# EAGLE design untitled (EAGLE 5.11)
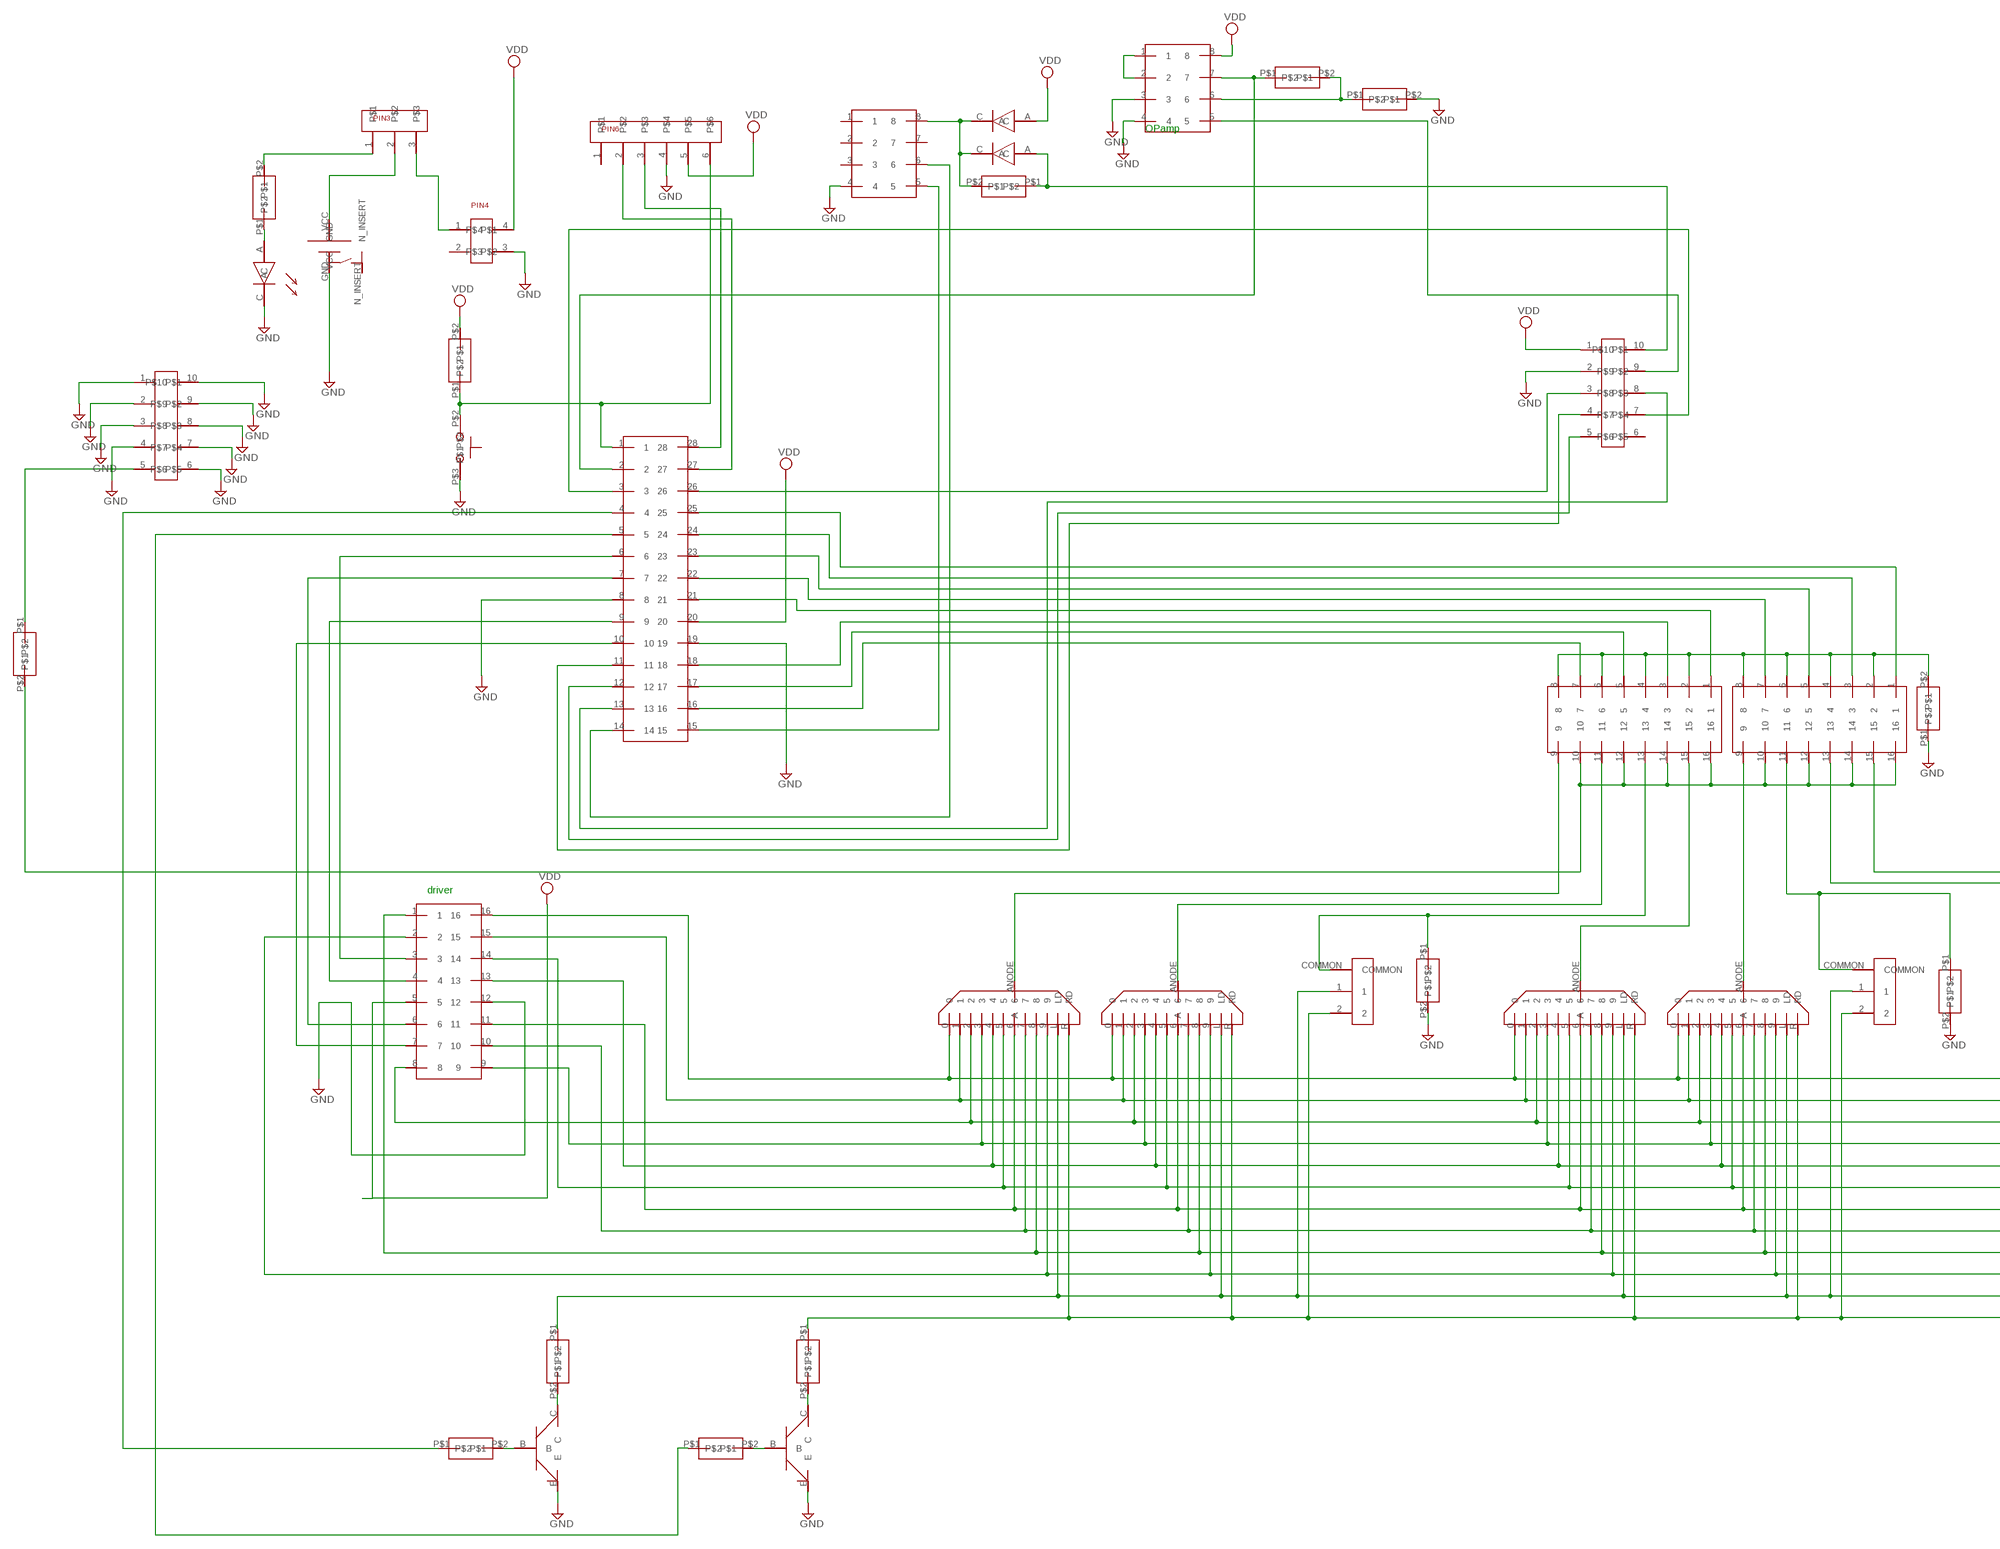
[diagram p0: schematic, sheet 1, part 1 of 2]
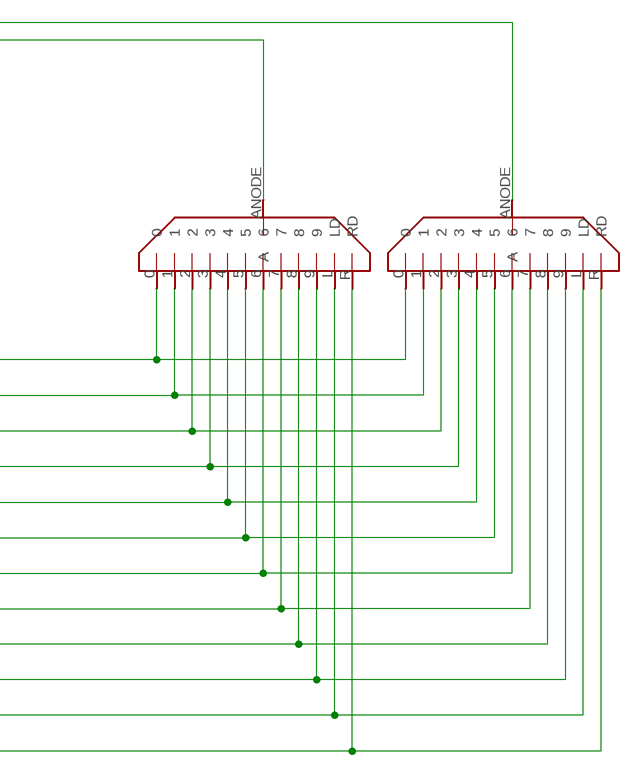
[diagram p1: schematic, sheet 1, part 2 of 2]

## Parts
U$1  DIP28  [DIP28]
U$2  DIP16  [DIP16]
U$3  DIP16  [DIP16]
U$4  DIP16  [DIP16]
U$5  DIP8  [DIP8]
U$6  DIP8  [DIP8]
U$7  NIXIE  [NIXIE]
U$8  NIXIE  [NIXIE]
U$9  NIXIE  [NIXIE]
U$10  NIXIE  [NIXIE]
U$11  NIXIE  [NIXIE]
U$12  NIXIE  [NIXIE]
U$13  NEON_COLON  [NEON_COLON]
U$14  NEON_COLON  [NEON_COLON]
U$15  ACADUPTER  [ACADUPTER]
U$16  PIN10  [PIN10]
U$17  PIN10  [PIN10]
U$18  DIORDE  [DIORDE]
U$19  DIORDE  [DIORDE]
U$20  REGISTER  [REGISTER]
U$21  REGISTER  [REGISTER]
U$22  TRANSISTOR  [TRANSISTOR]
U$23  TRANSISTOR  [TRANSISTOR]
U$24  REGISTOR_STAND  [REGISTOR_STAND]
U$25  REGISTOR_STAND  [REGISTOR_STAND]
U$26  REGISTER  [REGISTER]
U$27  REGISTER  [REGISTER]
U$28  PIN4  [PIN4]
U$29  PIN6  [PIN6]
U$30  REGISTER  [REGISTER]
U$31  SWITCH  [SWITCH]
U$32  REGISTER  [REGISTER]
U$33  REGISTOR_STAND  [REGISTOR_STAND]
U$34  REGISTOR_STAND  [REGISTOR_STAND]
U$35  PIN3  [PIN3]
U$36  LED  [LED]
U$37  REGISTOR_STAND  [REGISTOR_STAND]
U$38  REGISTER  [REGISTER]
U$39  REGISTER  [REGISTER]

## Nets
GND: U$1.8 U$1.19 U$2.12 U$5.4 U$6.3 U$6.4 U$15.GND U$16.1 U$16.2 U$16.3 U$16.4 U$16.6 U$16.7 U$16.8 U$16.9 U$16.10 U$17.2 U$21.P$1 U$22.E U$23.E U$27.P$2 U$28.3 U$29.4 U$31.P$3 U$36.C U$38.P$2 U$39.P$2
N$1: U$1.6 U$2.3
N$2: U$17.10 U$19.A U$20.P$1
N$3: U$1.12 U$17.5
N$4: U$1.15 U$5.5
N$5: U$1.14 U$5.6
N$6: U$3.13 U$13.COMMON U$38.P$1
N$7: U$2.16 U$7.0 U$8.0 U$9.0 U$10.0 U$11.0 U$12.0
N$8: U$2.8 U$7.2 U$8.2 U$9.2 U$10.2 U$11.2 U$12.2
N$9: U$2.9 U$7.3 U$8.3 U$9.3 U$10.3 U$11.3 U$12.3
N$10: U$2.13 U$7.4 U$8.4 U$9.4 U$10.4 U$11.4 U$12.4
N$11: U$2.14 U$7.5 U$8.5 U$9.5 U$10.5 U$11.5 U$12.5
N$12: U$2.11 U$7.6 U$8.6 U$9.6 U$10.6 U$11.6 U$12.6
N$13: U$2.10 U$7.7 U$8.7 U$9.7 U$10.7 U$11.7 U$12.7
N$14: U$2.1 U$7.8 U$8.8 U$9.8 U$10.8 U$11.8 U$12.8
N$15: U$2.2 U$7.9 U$8.9 U$9.9 U$10.9 U$11.9 U$12.9
N$17: U$4.11 U$14.COMMON U$39.P$1
N$18: U$16.5 U$32.P$1
N$19: U$4.15 U$7.ANODE(A)
N$20: U$22.B U$33.P$2
N$21: U$1.7 U$2.6
N$22: U$4.13 U$9.ANODE(A)
N$23: U$23.B U$34.P$2
N$24: U$1.11 U$17.4
N$27: U$3.10 U$3.12 U$3.14 U$3.16 U$4.10 U$4.12 U$4.14 U$4.16 U$32.P$2
N$28: U$1.1 U$29.6 U$30.P$1 U$31.P$2
N$30: U$1.16 U$3.7
N$31: U$1.17 U$3.5
N$32: U$1.18 U$3.3
N$33: U$1.21 U$3.1
N$34: U$1.22 U$4.7
N$35: U$1.23 U$4.5
N$36: U$1.24 U$4.3
N$37: U$1.25 U$4.1
N$38: U$1.10 U$2.7
N$39: U$5.8 U$18.C U$19.C U$20.P$2
N$40: U$1.9 U$2.4
N$41: U$22.C U$24.P$2
N$42: U$23.C U$25.P$2
N$43: U$1.28 U$29.3
N$44: U$1.26 U$17.3
N$45: U$1.27 U$29.2
N$46: U$1.2 U$6.7 U$26.P$1
N$47: U$6.6 U$26.P$2 U$27.P$1
N$48: U$6.5 U$17.9
N$49: U$6.1 U$6.2
N$50: U$1.4 U$33.P$1
N$51: U$1.5 U$34.P$1
N$52: U$28.1 U$35.3
N$53: U$4.9 U$11.ANODE(A)
N$54: U$1.13 U$17.8
N$55: U$3.15 U$8.ANODE(A)
N$56: U$3.11 U$10.ANODE(A)
N$57: U$3.9 U$12.ANODE(A)
N$59: U$7.R(RD) U$8.R(RD) U$9.R(RD) U$10.R(RD) U$11.R(RD) U$12.R(RD) U$13.2 U$14.2 U$25.P$1
N$60: U$15.VCC U$35.2
N$61: U$35.1 U$37.P$2
N$62: U$36.A U$37.P$1
N$63: U$1.3 U$17.7
N$64: U$3.2 U$3.4 U$3.6 U$3.8 U$4.2 U$4.4 U$4.6 U$4.8 U$21.P$2
N$65: U$2.15 U$7.1 U$8.1 U$9.1 U$10.1 U$11.1 U$12.1
N$66: U$7.L(LD) U$8.L(LD) U$9.L(LD) U$10.L(LD) U$11.L(LD) U$12.L(LD) U$13.1 U$14.1 U$24.P$1
VDD: U$1.20 U$2.5 U$6.8 U$17.1 U$18.A U$28.4 U$29.5 U$30.P$2
Unconnected: U$5.1 U$5.2 U$5.3 U$5.7 U$15.N_INSERT U$17.6 U$28.2 U$29.1

## Notes on the sheet
- OPamp
- driver

## Library data of the parts
U$1 = mylib:DIP28
U$2-U$4 = mylib:DIP16
U$5 U$6 = mylib:DIP8
U$7-U$12 = mylib:NIXIE: IN-16 Nixie Tube
U$13 U$14 = mylib:NEON_COLON
U$15 = mylib:ACADUPTER
U$16 U$17 = mylib:PIN10
U$18 U$19 = mylib:DIORDE
U$20 U$21 U$26 U$27 U$30 U$32 U$38 U$39 = mylib:REGISTER
U$22 U$23 = mylib:TRANSISTOR
U$24 U$25 U$33 U$34 U$37 = mylib:REGISTOR_STAND
U$28 = mylib:PIN4
U$29 = mylib:PIN6
U$31 = mylib:SWITCH
U$35 = mylib:PIN3
U$36 = mylib:LED

## Board
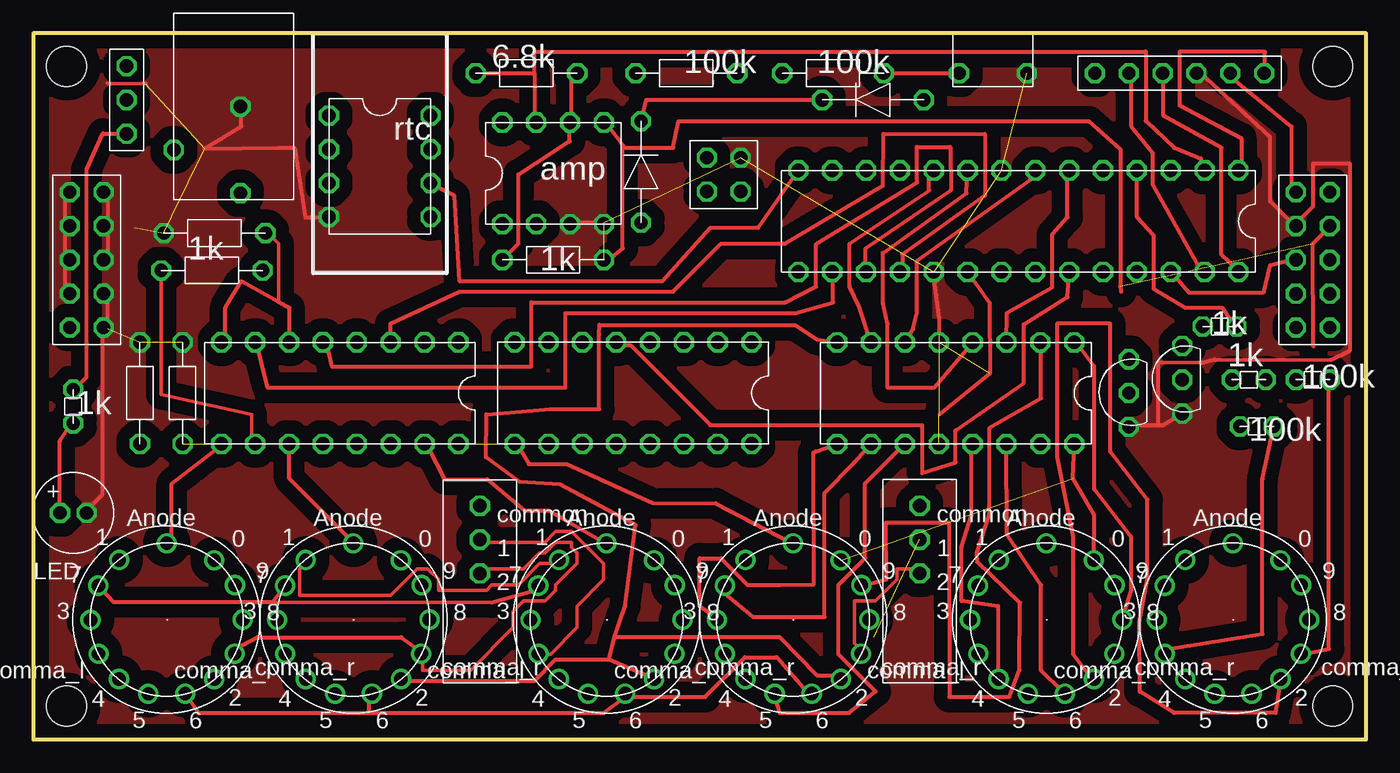
[diagram p2: board, top side]
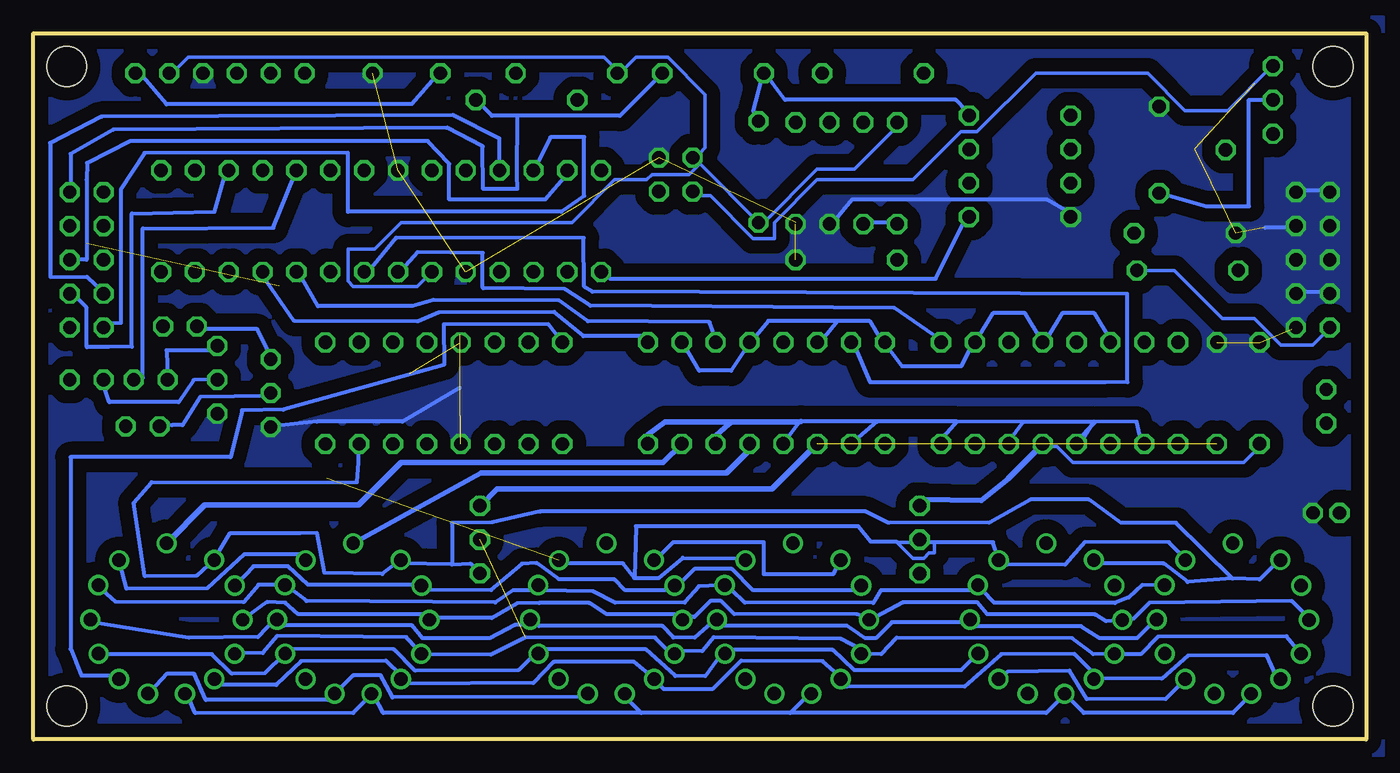
[diagram p3: board, bottom side, seen from below]

Size 100 x 53 mm. Coordinates in mm from the lower left corner, seen from the top.
Outline: 0,0 100,0 100,53 0,53 0,0
Copper layers (1*16): Top 0.035mm / dielectric 1.5mm / Bottom 0.035mm
Design rules "default": minimum track width 10mil, minimum drill 24mil, track to track 8mil, track to pad 8mil, pad to pad 8mil, via to via 8mil, smd to smd 8mil, copper to edge 40mil, drill to drill 8mil, minimum pad ring 10mil, minimum via ring 8mil, stop-mask expansion 4mil, vias tented up to drill 0mil, thermal gap 10mil
Holes 3 mm at 2.5,2.5 97.5,2.5 97.5,50.5 2.5,50.5

### Footprints (pad centres in the part's own frame; a part is rotated, then mirrored left to right if it is on the bottom)
DIP28 = drill 1 octagon: 1 -3.81,16.51; 2 -3.81,13.97; 3 -3.81,11.43; 4 -3.81,8.89; 5 -3.81,6.35; 6 -3.81,3.81; 7 -3.81,1.27; 8 -3.81,-1.27; 9 -3.81,-3.81; 10 -3.81,-6.35; 11 -3.81,-8.89; 12 -3.81,-11.43; 13 -3.81,-13.97; 14 -3.81,-16.51; 15 3.81,-16.51; 16 3.81,-13.97; 17 3.81,-11.43; 18 3.81,-8.89; 19 3.81,-6.35; 20 3.81,-3.81; 21 3.81,-1.27; 22 3.81,1.27; 23 3.81,3.81; 24 3.81,6.35; 25 3.81,8.89; 26 3.81,11.43; 27 3.81,13.97; 28 3.81,16.51
DIP16 = drill 1 octagon: 1 -3.81,8.89; 2 -3.81,6.35; 3 -3.81,3.81; 4 -3.81,1.27; 5 -3.81,-1.27; 6 -3.81,-3.81; 7 -3.81,-6.35; 8 -3.81,-8.89; 9 3.81,-8.89; 10 3.81,-6.35; 11 3.81,-3.81; 12 3.81,-1.27; 13 3.81,1.27; 14 3.81,3.81; 15 3.81,6.35; 16 3.81,8.89
DIP8 = drill 1 octagon: 1 -3.81,3.81; 2 -3.81,1.27; 3 -3.81,-1.27; 4 -3.81,-3.81; 5 3.81,-3.81; 6 3.81,-1.27; 7 3.81,1.27; 8 3.81,3.81
NIXIE = drill 1 round: 0 3.571,4.455; 1 -3.568,4.469; 2 3.58,-4.46; 3 -5.71,-0.024; 4 -3.578,-4.464; 5 1.4,-5.56; 6 -1.373,-5.57; 7 -5.116,2.549; 8 5.719,0; 9 5.122,2.587; ANODE 0.003,5.733; L -5.106,-2.567; R 5.102,-2.555
NEON_COLON = drill 1 octagon: 1 0,0; 2 0,-2.54; COMMON 0,2.54
ACADUPTER = drill 1 octagon: GND -3.5,0; N_INSERT -0.25,-5; VCC 3,0
PIN10 = drill 1 octagon: 1 -1.27,5.08; 2 -1.27,2.54; 3 -1.27,0; 4 -1.27,-2.54; 5 -1.27,-5.08; 6 1.27,-5.08; 7 1.27,-2.54; 8 1.27,0; 9 1.27,2.54; 10 1.27,5.08
DIORDE = drill 1 octagon: A -3.81,0; C 3.81,0
REGISTER = drill 1 octagon: P$1 -3.81,0; P$2 3.81,0
TRANSISTOR = drill 1 octagon: B 2.54,0; C 0,0; E -2.54,0
REGISTOR_STAND = drill 1 octagon: P$1 -1.27,0; P$2 1.27,0
PIN4 = drill 1 octagon: 1 -1.27,1.27; 2 -1.27,-1.27; 3 1.27,-1.27; 4 1.27,1.27
PIN6 = drill 1 octagon: 1 -6.35,0; 2 -3.81,0; 3 -1.27,0; 4 1.27,0; 5 3.81,0; 6 6.35,0
SWITCH = drill 1 octagon: P$2 -2.54,0; P$3 2.54,0
PIN3 = drill 1 octagon: 1 -2.54,0; 2 0,0; 3 2.54,0
LED = drill 1 octagon: A -1,0; C 1,0

### Placement (x,y rotation side)
U$1  73.91,38.9 270 top
U$2  69.21,25.99 270 top
U$3  23,26 270 top
U$4  45,26 270 top
U$5  25.99,43.02 0 top
U$6  39,42.5 90 top
U$7  90,9 0 top
U$8  43,9 0 top
U$9  76,9 0 top
U$10  24,9 0 top
U$11  57,9 0 top
U$12  10,9 0 top
U$13  33.5,15 0 top
U$14  66.5,15 0 top
U$15  15.54,44 270 top
U$16  4,36 0 top
U$17  96,36 0 top
U$18  45.6,42.6 90 top
U$19  63,48 180 top
U$20  49,50 180 top
U$21  13.6,38 0 top
U$22  82.2,26 90 top
U$23  86.2,27 90 top
U$24  91.8,23.5 180 top
U$25  96,27 180 top
U$26  37,50 0 top
U$27  39,36 0 top
U$28  51.8,42.4 90 top
U$29  86,50 0 top
U$30  60,50 180 top
U$31  72,50 0 top
U$32  13.4,35.2 180 top
U$33  89,31 180 top
U$34  91.2,27 180 top
U$35  7,48 90 top
U$36  3,17 0 top
U$37  3,25 90 top
U$38  8,26 90 top
U$39  11.2,26 90 top

### Tracks (layer width: path | path; a pad name or v marks a point on that pad's centre or on a via)
GND  (12 unrouted)
  Top 0.254: 8.46,49.26 8.4,49.2 5.6,49.2 5.55,49.27
  Top 0.3: U$29.4 87.6,50 92.8,45.2 92.8,40.4 94.4,38.8 U$17.2 94.8,38.8 96,40 96,43.2 98.8,43.2 98.8,29.2 97.34,28.5 88.58,28.53 87.7,28.29 84.4,28.32 84.4,23.6 | 84.4,23.6 84.8,23.6 U$23.E | 84.4,23.6 82.4,23.6 U$22.E | 68,30.4 68,31.6 67.6,34.4 U$1.19 | U$6.3 40.4,38.8 42.8,38.8 U$6.4 | U$5.4 22,39.2 20.4,39.2 19.6,44.4 18.4,44.4 12.85,44.35 15.6,46 15.6,47.2 U$15.GND | U$16.8 5.6,36.4 5.6,38.4 U$16.9 5.6,38.8 5.6,40.8 U$16.10 | U$16.4 2.4,33.6 2.4,36 U$16.3 2.4,36.4 2.4,38.4 U$16.2 2.4,38.8 2.4,40.8 U$16.1 | U$36.C 4,17.2 5.2,18.4 5.2,30.8 U$16.6 5.6,31.2 5.6,33.2 U$16.7
  Bottom 0.3: 68,26.4 72.31,23.86 78.71,23.86 82.17,23.48 U$22.E | 7.6,38.4 5.6,38.4 U$16.9 | U$16.4 2.8,33.6 5.2,33.6 U$16.7 | U$16.10 5.2,41.2 2.8,41.2 U$16.1 | U$6.3 40,38.8 38.59,40.52 23.91,40.52 22.4,39.6 U$5.4 | U$16.6 5.6,30.8
  pour Top (isolate 1.016, rank 6, no thermals): -0.94,53.88 100.47,53.48 100.47,-0.47 -0.54,-0.47
  pour Bottom (isolate 1.016, rank 6, no thermals): -1.27,54.21 100.8,53.81 100.8,-0.8 -1.27,-1.2
N$1
  Top 0.3: U$2.3 73.04,32 76.44,33.92 76.44,37.92 77.6,39.2 77.6,42.4 U$1.6
N$2
  Bottom 0.3: 63.69,46.82 65.6,46.8 U$19.A | 63.69,46.82 56,46.8 U$20.P$1 | 63.69,46.82 63.74,42.38 63.7,41.32 66.25,41.31 66.29,44.52 68.96,45.91 94.04,45.76 97.21,43.97 97.2,41.2 U$17.10
N$3
  Bottom 0.3: U$1.12 62.4,42.8 61.2,45.2 58.67,45.22 58.67,40.82 60.4,39.6 76.4,39.6 76.4,44.04 91.66,44.02 93.43,41.27 93.43,31.27 94.4,31.2 U$17.5
N$4
  Bottom 0.3: U$5.5 30,39.2 32.31,34.56 56.71,34.56 U$1.15
N$5
  Top 0.3: U$5.6 30,41.6 31.6,40.8 32,34.4 47.2,34.4 50.8,38.4 54.4,38.4 57.2,42.4 U$1.14
N$6
  Bottom 0.254: U$38.P$1 8,22 9.2,20.8 22,20.8 23.2,22 24,22 U$3.13
  Bottom 0.406: U$13.COMMON 33.6,17.54 33.6,18 28.86,17.94 26.8,19.6 26.86,19.6 U$3.13
N$7  (1 unrouted)
  Top 0.3: U$9.0 79.6,16.8 78,19.6 U$2.16
  Bottom 0.254: 32.4,14.8 32.4,14 32.8,14 33.2,13.6 34,13.6 35.2,14.8 35.2,14.82
  Bottom 0.3: U$7.0 93.48,13.15 93,11.31 86.95,11.35 84.18,13.91 79.78,13.91 U$9.0 | 54.9,12.13 55.74,13.21 60.4,13.2 U$11.0 | 54.9,12.13 53.07,12.11 51.26,13.63 46.8,13.6 U$8.0 | U$12.0 13.6,13.6 14.8,14.8 21.12,14.82 22.57,13.13 26.93,13.11 U$10.0 27.6,13.6 28,14.8 32.4,14.8 33.2,14.8 | 54.9,12.13 54.8,16 38.1,16 37.16,14.84 35.2,14.82 33.6,14.8
N$8
  Top 0.3: 43.6,7.7 56,7.7 58.8,4.8 60.4,4.8 U$11.2 | 43.2,6 46,4.8 U$8.2 | 43.2,6 43.6,7.7 | 43.2,6 39.2,6 37.6,4.4 27.6,4.4 U$10.2 | U$9.2 79.2,4.8 78,6.4 78,15.2 76.8,21.2 76.8,31.2 80.8,31.2 80.8,21.6 83.6,18 83.6,12 82.98,8.81 83,3.62 85.6,2 93.2,2 U$7.2 | 43.6,7.7 44.4,10 45.2,16.1 39.51,19.14 36.5,19.33 33.96,21.17 34,24.4 38.8,24.8 42.46,24.8 42.46,30.4 42.48,31.12 57.16,31.1 58.8,30 U$2.8
  Bottom 0.3: U$12.2 13.84,4.24 15.04,3.04 20.96,3.02 22.26,5.17 26.93,5.07 U$10.2 | U$7.2 93.6,4.8 96.4,4.8 97.2,6.8 97.2,21.2 85.2,21.2 84.34,24.7 81.22,24.76 69.2,28.11 69.21,31.15 61.36,31.18 60.21,29.72 U$2.8
N$9
  Top 0.3: U$2.9 58.71,21.62 58.51,21.52 58.56,11.66 56,11.6 53.6,11.6 51.6,13.6 50,13.6 50,10 51.2,9.2 U$11.3
  Bottom 0.3: U$12.3 4.4,9.2 5.6,10.4 16.26,10.27 17.46,9.07 U$10.3 19.5,8.87 20.33,9.38 28.42,9.4 29.16,10.29 34.76,10.29 36.8,9.2 U$8.3 37.6,9.2 38.22,9.41 47.43,9.42 48.4,10.4 49.2,10.4 50.4,9.2 51.2,9.2 U$11.3 51.63,9.38 56.95,9.41 58.29,10.24 62.05,10.25 63.69,10.22 65.58,9.13 69.91,9.13 70,9.2 U$9.3 70.58,9.38 80.12,9.4 81.09,10.27 82.44,10.32 84,9.2 U$7.3
N$10
  Top 0.3: U$2.13 70.4,22 70.4,16.8 69.63,14.4 69.63,10.4 72.4,10 72.4,4.8 U$9.4
  Bottom 0.3: U$12.4 6.8,4.8 7.47,6.33 13.37,6.29 15.34,4.57 20.64,4.6 U$10.4 20.7,5.23 21.9,6.43 27.37,6.41 30.14,3.96 38.99,3.99 U$8.4 39.6,4.8 40.78,5.87 46.9,5.92 49.06,3.78 52.69,3.78 U$11.4 53.4,4.54 54.95,5.84 60.96,5.82 62.48,4.25 71.96,4.19 U$9.4 72.42,4.83 73.54,5.92 79.92,5.89 81.76,4.09 86.37,4.09 U$7.4
N$11
  Top 0.3: 25.2,2 12.4,2 11.6,3.2 U$12.5 | 25.2,2 25.2,3.2 U$10.5 | 25.2,2 42.8,2 44.4,3.2 U$8.5 44.8,3.2 50.4,3.2 53.38,6.17 55.78,6.17 58,3.6 U$11.5 | U$2.14 73.04,15.4 75.6,11.6 75.6,5.2 77.2,3.6 U$9.5
  Bottom 0.3: U$11.5 58.4,3.2 73.06,3.15 73.96,4.83 76,4.8 77.2,3.6 U$9.5 77.86,2.97 87.06,2.97 87.93,4.93 90,4.93 91.2,3.6 U$7.5
N$12
  Top 0.3: U$2.11 64.4,21.2 62.4,19.2 62.4,13.6 60.4,11.6 60.4,6.4 63.2,3.6 61.2,2 56,2 55.6,3.2 U$11.6
  Bottom 0.3: U$12.6 8.8,3.2 10,2 21.2,2 22.4,3.2 U$10.6 22.8,3.2 24,2 43.2,2 | U$7.6 88.4,3.2 87.85,1.98 76,2 74.8,3.2 U$9.6 74.4,3.2 73.75,2 54.4,2 | 43.2,2 42,3.2 U$8.6 | 43.2,2 54.4,2 | 54.4,2 55.6,3.2 U$11.6
N$13
  Top 0.3: 18,10.32 6,10.32 5.2,11.2 U$12.7 | U$2.10 61.6,20.8 59.36,18.51 59.36,9.2 54,9.2 51.6,11.2 U$11.7 | 18,10.32 34.4,10.29 37.6,11.2 U$8.7 | 18,10.32 U$10.7
  Bottom 0.3: U$7.7 84.8,11.6 83.47,13 80.88,13.01 79.39,11.62 71.2,11.6 U$9.7 70.8,11.2 65.64,11.22 63.34,13.19 62.26,13.24 60.57,12.03 56.4,12 55.6,11.2 52,11.2 U$11.7 51.6,11.6 50.4,12.8 47.6,12.8 46,11.2 38.4,11.2 38,11.6 U$8.7
N$14
  Top 0.3: U$2.1 78.4,29.6 79.6,28 79.6,18.8 82.37,15.22 82.4,11.2 82,10 U$9.8
  Bottom 0.3: U$7.8 95.6,8.8 88.33,7.65 83.14,7.7 81.93,8.96 U$9.8 81.6,8.8 81.2,8.56 71.6,8.56 70.8,7.6 65.76,7.6 63.88,8.6 62.83,8.6 U$11.8 62.4,8.8 62.08,8.53 52.81,8.53 51.98,7.67 50.38,7.63 49.13,8.77 U$8.8 48.4,8.8 48.57,8.54 38.97,8.54 37.6,7.6 36.8,7.6 35.6,8.8 30,8.8 U$10.8 29.4,8.51 21.41,8.51 20,7.6 17.2,7.6 16,8.8 U$12.8
N$15
  Top 0.3: U$2.2 75.6,29.2 75.6,25.6 71.75,23.36 71.73,16.85 70.8,14 70.83,13.32 74.04,10.26 74,5.2 73.24,3.22 68.72,3.2 68.69,16.28 63.97,16.28 64,12 62.4,11.6 U$11.9
  Bottom 0.3: U$12.9 16.8,11.6 17.81,10.66 18.85,10.25 27.9,10.26 28.8,11.2 U$10.9 29.2,11.2 36.4,11.2 36.98,10.26 46.63,10.29 47.6,11.2 U$8.9 48.56,11.56 50.06,11.49 51.14,10.29 56.34,10.27 58.02,11.13 62,11.2 62.12,11.32 U$11.9 62.4,11.2 64,11.2 65.34,10.29 79.49,10.4 80.56,11.18 U$9.9 81.51,11.62 83.11,11.62 84.22,10.3 93.84,10.34 94.8,11.2 U$7.9
N$17  (1 unrouted)
  Bottom 0.406: U$14.COMMON 66.46,17.54 65.2,18.8 44.58,18.8 U$4.11
N$18
  Bottom 0.254: 2.8,30.8 4,29.6 6.4,29.6 8.4,31.6 10.8,31.6 14.4,35.2 U$32.P$1
  Bottom 0.3: 2.68,30.8 2.8,30.8 U$16.5
N$19
  Bottom 0.406: U$4.15 52.74,20.8 72.4,20.8 75.6,17.6 87.13,17.6 U$7.ANODE
N$20
  Bottom 0.3: U$22.B 82,28.4 83.2,30.8 87.6,30.8 U$33.P$2
N$21
  Top 0.3: U$2.6 66,30.8 66.28,32 66.31,35.93 74.8,42 74.8,42.4 U$1.7
N$22
  Bottom 0.3: U$9.ANODE 76,14.8
  Bottom 0.406: U$4.13 46.27,21.73 48,20 66.4,20 U$9.ANODE
N$23
  Bottom 0.3: U$23.B 86.4,29.2 90,29.2 U$34.P$2
N$24
  Bottom 0.3: U$1.11 65.03,45.1 68.51,46.86 94.9,46.73 98.75,44.77 98.73,34.71 95.98,34.74 94.8,33.6 U$17.4
N$27
  Top 0.254: U$32.P$2 9.6,34.68 9.6,25.88 16.4,24.4 16.4,22.4 U$3.10
  Bottom 0.3: U$3.10 16.8,22 17.22,23.84 20.44,23.87 21.6,22 U$3.12 21.75,22.38 20.31,23.84 25.74,23.84 | 25.74,23.84 26.8,22.4 U$3.14 | 25.74,23.84 30.7,23.87 | 30.7,23.87 32,22.4 U$3.16 | 36.7,23.87 38.4,22.4 U$4.10 | 30.7,23.87 36.7,23.87 | 36.7,23.87 42.4,23.86 42.52,23.86 43.6,22.4 U$4.12 44,22
  Bottom 0.406: U$4.14 48.81,22.79 47.76,23.73 | 47.76,23.73 47.64,23.85 42.58,23.85 42.4,23.86 | U$4.16 53.89,22.91 52.59,23.84 47.82,23.84 47.76,23.73
N$28
  Top 0.3: U$30.P$1 U$31.P$2 | U$1.1 90.4,42.8 90.63,43.14 90.63,45.14 86,47.6 86,51.6 92.4,51.6 92.4,50 U$29.6
  Bottom 0.3: U$31.P$2 69.6,50 71.61,47.69 90,47.67 92,50 U$29.6
N$30
  Top 0.3: U$3.7 16.8,29.6 17.6,26.4 39.92,26.4 39.92,32 57.2,32 60,32.8 60,34.4 U$1.16
N$31
  Top 0.3: U$3.5 22,29.6 22.4,28 37.38,28 37.38,32.8 56.4,32.8 58.72,33.98 58.72,37.18 66.3,41.8 66.28,44.47 68.8,44.47 68.84,41.2 62.4,36.8 62.4,35.2 U$1.17
N$32
  Top 0.3: U$3.3 26.8,30 26.8,31.2 32,33.6 48,33.6 51.6,37.2 56.4,37.2 63.74,41.55 63.78,45.45 71.38,45.44 71.38,40.8 65.2,36.4 65.2,35.2 U$1.18
N$33
  Bottom 0.3: U$3.1 32,30 35.41,32.4 58.21,32.55 60.1,33.8 66.25,33.86 66.31,33.97 66.28,36.52 71.19,36.58 72.4,35.2 U$1.21
N$34
  Bottom 0.3: U$4.7 38.4,29.6 37.2,26.8 19.6,26.8 17.9,26.82 17.92,33.44 58.05,33.61 58.67,34.01 58.7,37.64 72.77,37.65 74.8,35.2 U$1.22
N$35
  Top 0.3: U$4.5 44,29.6 44.8,29.6 50.8,23.6 66.69,23.6 66.69,20 69.2,20.8 69.2,23.2 74.3,26.76 74.3,31.16 77.6,33.2 U$1.23
N$36
  Bottom 0.3: U$4.3 48.8,30 49.27,31.31 58.41,31.39 60.56,32.95 69.98,32.99 71.56,32.53 78.65,32.52 80,34.8 U$1.24
N$37
  Bottom 0.3: U$4.1 54,30 53.94,30.27 58.73,30.27 60.92,32.08 69.58,32.05 71.18,31.38 80.42,31.41 82.8,34.8 U$1.25
N$38
  Top 0.3: U$2.7 62,32.4 61.24,34 61.24,37.2 67.2,41.2 67.2,42.4 U$1.10
N$39
  Top 0.3: U$19.C 46,48 U$18.C
  Bottom 0.3: 45.22,50.2 44.8,50 U$20.P$2 | 45.22,50.2 43.6,48 30.8,48 30,47.2 U$5.8 | 45.22,50.2 46,47.2 U$18.C
N$40
  Top 0.3: U$2.4 67.6,26.4 64.1,26.4 64.1,31.2 63.75,32.79 63.74,36.52 70.02,41 U$1.9
N$41
  Bottom 0.3: U$24.P$2 89.6,23.6 88.8,23.6 87.47,25.71 82.39,25.78 82.4,26 U$22.C
N$42
  Bottom 0.3: U$23.C 87.97,26.97 89.11,25.33 94.31,25.33 94.8,26.8 U$25.P$2
N$43
  Top 0.3: U$29.3 84.8,50 84.8,46.8 89.14,44.4 89.14,36.4 90.4,35.2 U$1.28
N$44
  Top 0.3: U$1.26 85.6,34.8 86.71,33.55 92.31,33.55 92.8,35.6 94.4,36 U$17.3
N$45
  Top 0.3: U$1.27 87.6,35.2 84,41.6 84,44 82.4,46 82.4,50 U$29.2
N$46
  Top 0.3: 37.6,50 37.6,46.4 U$6.7 | U$26.P$1 37.6,50 | 37.6,50 37.6,51.6 83.46,51.64 83.46,46.44 85.6,44.4 87.6,43.6 U$1.2
N$47
  Top 0.3: U$27.P$1 36.4,37.2 36.4,42.4 40.23,44.9 U$6.6 40.4,46.4 40.4,49.6 U$26.P$2
N$48  (1 unrouted)
  Top 0.3: 43.2,36 44.21,36.85 44.21,44.45 44.4,44.4 | 44.4,44.4 43.2,46 U$6.5 | 96.04,29.51 96,37.2 97.2,38.4 U$17.9 | 81.6,33.6 81.54,34.02 81.54,44.32 79.2,46.4 48.4,46.4 48,44.4 44.4,44.4
N$49
  Bottom 0.3: U$6.1 35.2,38.8 37.6,38.8 U$6.2
N$50
  Top 0.3: U$33.P$1 90,31.2 89.2,32.4 86.4,32.4 84.06,33.82 84.06,37.82 82.8,39.2 U$1.4
N$51
  Bottom 0.3: U$34.P$1 91.78,27.16 91.78,38.36 82,38.4 80.4,42.4 U$1.5
N$52
  Bottom 0.254: U$35.3 7.2,50.4 10.4,47.2 13.6,47.2 16.4,50 24.8,50 29.2,45.6 30.4,45.6 34,42 41.2,42 44.4,38.8 44.4,37.6 46,37.6 49.2,40.8 50.4,40.8 U$28.1
N$53
  Top 0.3: U$11.ANODE 56.8,14.8 51.2,17.73 46.47,17.74 39.99,20.66 37.19,20.66 36.4,22 U$4.9
N$54
  Bottom 0.3: U$17.8 97.2,36 96,36 96,42 95.96,43.27 92.72,44.91 70.41,44.91 68.8,43.2 68.8,40.52 61.6,40.52 60,42.4 U$1.13
N$55
  Top 0.3: U$8.ANODE 42.8,14.8 38.61,17.18 36.87,17.2 34.07,19.53 30.87,19.53 29.6,22 U$3.15
N$56
  Top 0.3: U$10.ANODE 24,14.8 19.2,19.6 19.2,22 U$3.11
N$57
  Top 0.3: U$12.ANODE 10.4,14.8 10.4,19.2 14,22 U$3.9
N$59
  Top 0.254: U$13.2 33.6,12.8 36.8,12.8 38,14 38.4,14 39.2,14.8 40.4,14.8 40.4,14.4 40.8,14 40.8,13.2 39.2,11.6 39.2,11.2 38.4,10.4 36.8,10.4 36,9.6 36,8.4 32.8,5.2 29.2,5.2 29.2,6.4 U$10.R | U$14.2 66.4,12.8 64.8,12.8 64.8,12 63.2,10.4 61.6,10.4 61.6,7.2 62,6.8 U$11.R
  Top 0.3: U$12.R 15.2,6.8 16.8,7.68 27.6,7.68 28.8,6.8 U$10.R | U$25.P$1 97.2,26.8 97.2,6.8 95.2,6.4 U$7.R
  Bottom 0.3: U$7.R 94.8,6.4 86.61,6.39 85.11,4.95 82.64,4.98 81.2,6.4 U$9.R 80.8,6.8 72.95,6.77 71.35,5.17 63.6,5.2 62.4,6.4 U$11.R 62.02,6.75 54.02,6.75 51.83,4.78 49.59,4.74 48.4,6.4 U$8.R 48.02,6.73 40.02,6.73 38.4,5.2 30.4,5.2 29.2,6.4 U$10.R
N$60
  Bottom 0.3: U$35.2 8.8,48 8.8,40 12,40 U$15.VCC
N$61
  Top 0.3: U$37.P$2 3.2,26.4 4,27.2 4,42.8 5.22,45.47 U$35.1
N$62
  Top 0.3: U$36.A 2,22.4 2.8,23.6 U$37.P$1
N$63
  Bottom 0.3: U$17.7 97.2,33.2 97.2,33.6 96,32.4 95.99,29.45 94.37,29.46 92.6,29.48 92.6,39.48 86.4,39.6 85.6,42.4 U$1.3
N$64
  Top 0.254: U$21.P$2 17.6,38 18.4,37.2 18.4,32.8 18.42,32.83
  Top 0.3: U$3.8 14.4,30 14.4,32.4 15.6,34.4 18.42,32.83 19.2,32.4 U$3.6
  Bottom 0.3: 39.66,31.42 37.24,31.4 36.4,30 U$4.8 36,29.6 34.8,28 30.4,28 29.6,29.6 U$3.2 29.2,30 28,32 25.6,32 24.4,30 U$3.4 24,30 22.8,32 20.4,32 19.2,30 U$3.6 | 39.66,31.42 40.8,30 U$4.6 | 39.66,31.42 44.86,31.42 46,30 U$4.4 46.4,29.6 47.64,27.68 50.04,27.68 51.2,29.6 U$4.2
N$65
  Top 0.254: U$8.1 39.2,13.2 38,13.2 36.4,11.6 34.4,11.6 34,11.2 30.4,11.2 30.4,12 29.6,12.8 28.8,12.8 26.8,10.8 20,10.8 20,12.8 20.4,13.2 U$10.1
  Bottom 0.3: 66.8,12.8 67.2,13.2 68.6,13.14 | 68.6,13.14 72.4,13.2 U$9.1 72.8,13.2 73.82,12.42 78.15,12.52 78.71,15.49 80.01,15.49 85.27,15.46 86.4,13.6 U$7.1 87.75,12.29 91.64,12.26 92.47,17.74 91.12,19.3 75.72,19.33 75.6,20.8 U$2.15 | 10.03,12.08 13.39,11.82 15.2,13.2 20.4,13.2 U$10.1 | 10.03,12.08 8,12 6.8,13.2 U$12.1 | U$11.1 53.2,13.6 52,14.8 45.2,14.8 45.2,12.4 40,12.4 U$8.1 | 68.6,13.14 68.6,16.24 65.58,16.3 61.97,17.12 37.57,17.12 35.84,16.27 28.28,16.28 25.2,18 20.8,18 18.4,16.27 14.27,16.27 10.03,12.08
N$66  (1 unrouted)
  Top 0.254: U$13.1 33.6,14.8 38.4,14.8 39.2,15.6 40.4,15.6 42.8,13.2 42.8,12 40.8,10 40.8,8.4 38.8,6.4 38,6.4 U$8.L
  Top 0.3: U$7.L 85.2,6.8 92.22,7.92 92.22,19.52 U$24.P$1
  Bottom 0.3: U$12.L 5.2,6.8 5.98,7.76 15.63,7.72 16.92,6.41 18.52,6.41 U$10.L 20.47,6.4 22.07,7.6 35.23,7.63 36.39,6.41 37.18,6.42 U$8.L 38,6.8 39.4,7.54 48.95,7.67 49.81,6.65 51.84,6.64 U$11.L 52.55,6.83 53.35,7.63 63.08,7.68 65.68,6.36 70.75,6.39 U$9.L 71.2,6.8 72.02,7.68 81.72,7.76 82.79,6.49 84.96,6.46 U$7.L
VDD  (1 unrouted)
  Top 0.3: 68,24.4 71.78,27.48 71.74,32.76 U$1.20 | U$29.5 90,49.6 94.4,46 94.4,41.2 U$17.1
  Bottom 0.254: U$18.A 45.2,38.8 41.2,42.8 38.4,42.8 35.2,46 U$6.8 | U$18.A 50,43.2 | 50,43.2 50.4,43.6 U$28.4 | U$18.A | 56,50 54.8,51.2 52.4,51.2 49.6,48.4 49.6,44.4 50,44 50.4,44 U$28.4 | 56,50 57.2,51.2 88.4,51.2 89.6,50 U$29.5 | 56,50 U$30.P$2 | 50,43.2 50.8,42.4 53.6,42.4 54,42 56.4,42 59.6,38.8 72.4,38.8 74.4,36.8 76.4,36.8 76.4,34.4 76,34 71.2,34 70.4,34.8 U$1.20 | 50,43.2 U$28.4

### Text on the board
tPlace: 6.8k | 100k | 100k | 1k | 1k | 1k | 1k | 100k | 1k | 100k
tNames: rtc | amp